# EAGLE schematic Shematic (EAGLE 9.5.1)
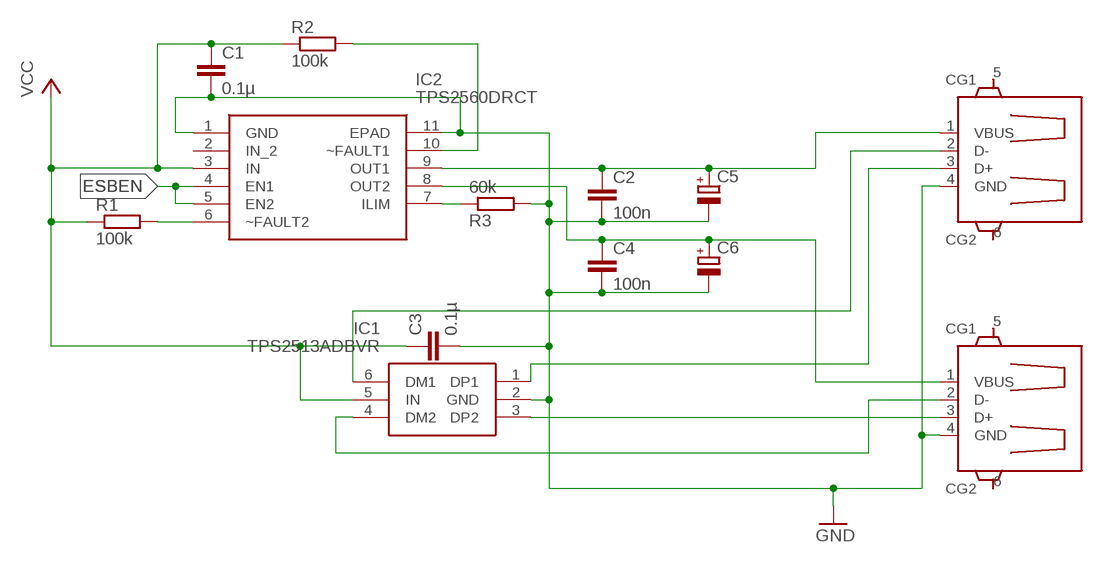
[diagram p0: schematic, sheet 1]

## Parts
C1  0.1µ  C-EUC0805  [C0805]
C2  100n  C-EUC1206  [C1206]
C3  0.1µ  C-EUC1206  [C1206]
C4  100n  C-EUC1206  [C1206]
C5  CPOL-EU150CLZ-1010  [150CLZ-1010]
C6  CPOL-EU150CLZ-1010  [150CLZ-1010]
IC1  TPS2513ADBVR  [SOT95P280X145-6N]
IC2  TPS2560DRCT  [SON50P300X300X100-11N]
R1  100k  R-EU_R1206  [R1206]
R2  100k  R-EU_R1206  [R1206]
R3  60k  R-EU_R1206  [R1206]
X1  GHI2_USB_HOST_W/CHASSIS_GND  [GHI2_USB_HOST_HORIZONTAL_W/CHASSIS_GND]
X2  GHI2_USB_HOST_W/CHASSIS_GND  [GHI2_USB_HOST_HORIZONTAL_W/CHASSIS_GND]

## Nets
DM2: IC1.4(DM2) X2.2(D-)
DP2: IC1.3(DP2) X2.3(D+)
ESBEN: IC2.4(EN1) IC2.5(EN2)
GND: C1.2 C2.2 C3.2 C4.2 C5.- C6.- IC1.2(GND) IC2.1(GND) IC2.11(EPAD) R3.2 X1.4(GND) X2.4(GND)
ILIM: IC2.7(ILIM) R3.1
N$1: IC2.6(~FAULT2) R1.2
N$2: IC2.10(~FAULT1) R2.2
N$3: C2.1 C5.+ IC2.9(OUT1) X1.1(VBUS)
N$4: IC1.6(DM1) X1.2(D-)
N$6: IC1.1(DP1) X1.3(D+)
N$7: C4.1 C6.+ IC2.8(OUT2) X2.1(VBUS)
VCC: C1.1 C3.1 IC1.5(IN) IC2.3(IN) R1.1 R2.1
Unconnected: IC2.2(IN_2) X1.5(CG1) X1.6(CG2) X2.5(CG1) X2.6(CG2)

## Library data of the parts
C1-C4 = rcl:C-EU: CAPACITOR, European symbol; SPICEPREFIX: C
C5 C6 = rcl:CPOL-EU: POLARIZED CAPACITOR, European symbol; SPICEPREFIX: C
IC1 = SamacSys_Parts:TPS2513ADBVR: Dual USB Dedicated Charging Port Controllers Source: Datasheet <http://www.ti.com/lit/gpn/tps2513a>; DESCRIPTION: Dual USB Dedicated Charging Port Controllers; HEIGHT: 1.45mm; MANUFACTURER_NAME: Texas Instruments; MANUFACTURER_PART_NUMBER: TPS2513ADBVR; MOUSER_PART_NUMBER: 595-TPS2513ADBVR; MOUSER_PRICE-STOCK: https://www.mouser.com/Search/Refine.aspx?Keyword=595-TPS2513ADBVR
IC2 = SamacSys_Parts:TPS2560DRCT: Dual Channel Precision Adjustable Current-Limited Power Switches Source: Datasheet <http://componentsearchengine.com/Datasheets/1/TPS2560DRCT.pdf>; DESCRIPTION: Dual Channel Precision Adjustable Current-Limited Power Switches; HEIGHT: mm; MANUFACTURER_NAME: Texas Instruments; MANUFACTURER_PART_NUMBER: TPS2560DRCT; MOUSER_PART_NUMBER: 595-TPS2560DRCT; MOUSER_PRICE-STOCK: https://www.mouser.com/Search/Refine.aspx?Keyword=595-TPS2560DRCT; RS_PART_NUMBER: 8120424P; RS_PRICE-STOCK: http://uk.rs-online.com/web/p/products/8120424P
R1-R3 = rcl:R-EU_: RESISTOR, European symbol; SPICEPREFIX: R
X1 X2 = BeagleBone_Black_Wireless:GHI2_USB_HOST_W/CHASSIS_GND